# Altium schematic sheet GPS.SchDoc: GPS module
size A4; Author: L. Sartory; Organization: L. Sartory; Address2: Nixie clock; Address3: with GPS synchronization; DocumentNumber: 8; Revision: B1; SheetNumber: 8; SheetTotal: 12
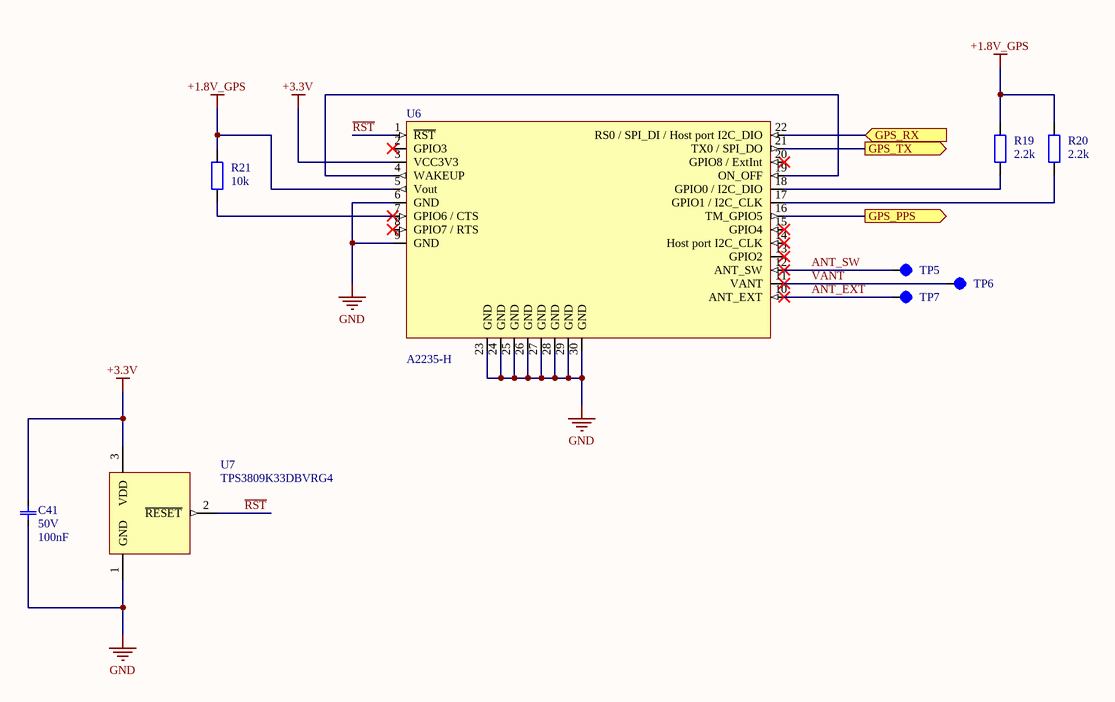
[diagram p0: GPS.SchDoc]

## Parts
C41  Voltage: 50V  [MLCC_0603]  (hidden comment: 100nF)
R19  2.2k  [RES0805]
R20  2.2k  [RES0805]
R21  10k  [RES0805]
TP5  Test_point_1mm  [TEST_POINT_1MM]  (value not drawn)  (no BOM)
TP6  Test_point_1mm  [TEST_POINT_1MM]  (value not drawn)  (no BOM)
TP7  Test_point_1mm  [TEST_POINT_1MM]  (value not drawn)  (no BOM)
U6  A2235-H  [A2235]
U7  TPS3809K33DBVRG4  [TPS3809K33DBVRG4]

## Ports
GPS_PPS (out), GPS_RX (in), GPS_TX (out)

## Nets
+1.8V_GPS: R19.2 R20.2 R21.2 U6.5(Vout)
+3.3V: C41.2 U6.3(VCC3V3) U7.3(VDD)
GND: C41.1 U6.6(GND) U6.9(GND) U6.23(GND) U6.24(GND) U6.25(GND) U6.26(GND) U6.27(GND) U6.28(GND) U6.29(GND) U6.30(GND) U7.1(GND)
ANT_EXT: TP7.TP U6.10(ANT_EXT)
ANT_SW: TP5.TP U6.12(ANT_SW)
GPS_PPS: U6.16(TM_GPIO5) ; port GPS_PPS
GPS_RX: U6.22(RS0_/_SPI_DI_/_Host_port_I2C_DIO) ; port GPS_RX
GPS_TX: U6.21(TX0_/_SPI_DO) ; port GPS_TX
~{RST}: U6.1(~{RST}) U7.2(~{RESET})
VANT: TP6.TP U6.11(VANT)
NetR19_1: R19.1 U6.18(GPIO0_/_I2C_DIO)
NetR20_1: R20.1 U6.17(GPIO1_/_I2C_CLK)
NetR21_1: R21.1 U6.7(GPIO6_/_CTS)
NetU6_4: U6.4(WAKEUP) U6.19(ON_OFF)

Not connected (* = marked no-connect by the designer): U6 2(GPIO3)* 8(GPIO7_/_RTS)* 13(GPIO2)* 14(Host_port_I2C_CLK)* 15(GPIO4)* 20(GPIO8_/_ExtInt)*

## Notes on the sheet
- Title
- Size:
- Date:
- A4
- Number:
- Time:
- Revision:
- Sheet
- of
- File:
- (in symbol 2.2k 0805) Text
- (in symbol 10k 0805) Text

## Library data of the parts
C41 = MLCC 100nF 50V 0603: Value: 100nF
R19 R20 = 2.2k 0805: Chip resistor 2.2k 0805; Value: 2.2k
R21 = 10k 0805: Chip resistor 10k 0805; Value: 10k
TP5-TP7 = Test_point_1mm: 1mm test point
U6 = A2235-H: GPS module
U7 = TPS3809K33DBVRG4: 3.3V supervisor